# EAGLE design 362MiniProj (EAGLE 7.5.0)
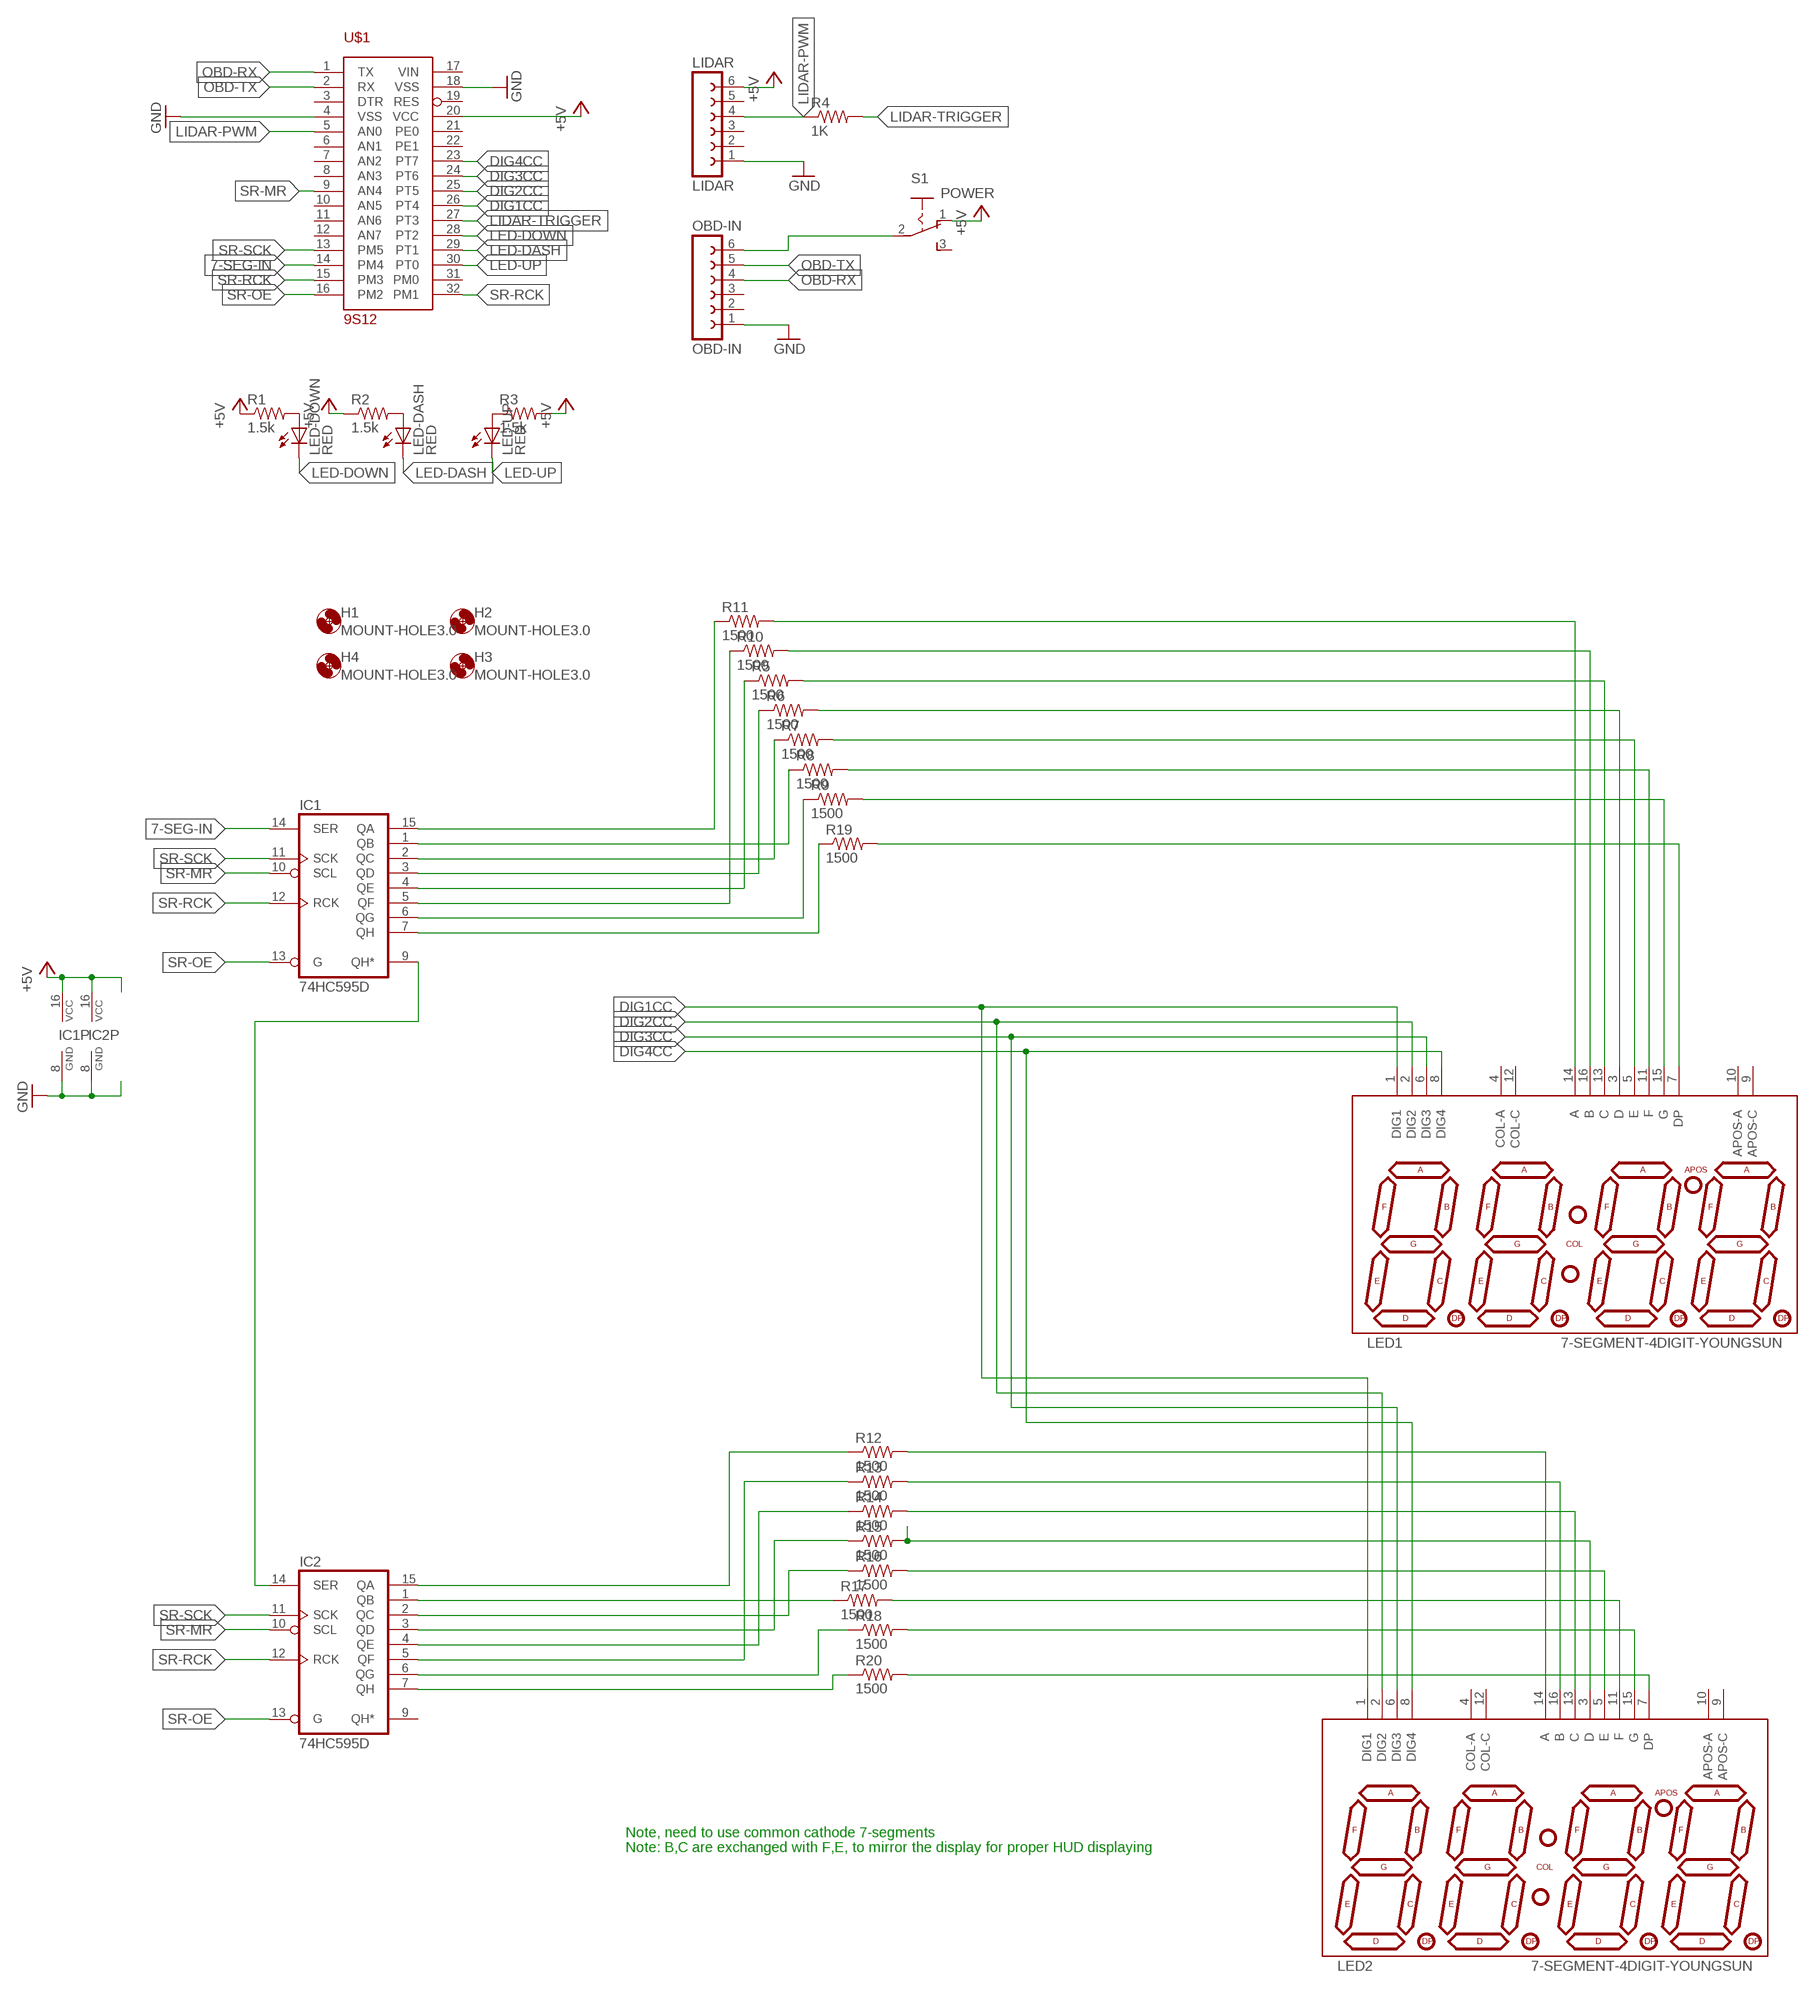
[diagram p0: schematic, sheet 1]

## Parts
H1  MOUNT-HOLE3.0  [3,0]
H2  MOUNT-HOLE3.0  [3,0]
H3  MOUNT-HOLE3.0  [3,0]
H4  MOUNT-HOLE3.0  [3,0]
IC1  74HC595D  [SO16]
IC2  74HC595D  [SO16]
LED1  7-SEGMENT-4DIGIT-YOUNGSUN  [7-SEGMENT-4DIGIT-YOUNGSUN]
LED2  7-SEGMENT-4DIGIT-YOUNGSUN  [7-SEGMENT-4DIGIT-YOUNGSUN]
LED-DASH  RED  LED_E  [LED_1206]
LED-DOWN  RED  LED_E  [LED_1206]
LED-UP  RED  LED_E  [LED_1206]
LIDAR  LIDAR  FE06-1  [FE06]
OBD-IN  OBD-IN  FE06-1  [FE06]
R1  1.5k  R-US_M1206  [M1206]
R2  1.5k  R-US_M1206  [M1206]
R3  1.5k  R-US_M1206  [M1206]
R4  1K  R-US_M1206  [M1206]
R5  1500  R-US_M1206  [M1206]
R6  1500  R-US_M1206  [M1206]
R7  1500  R-US_M1206  [M1206]
R8  1500  R-US_M1206  [M1206]
R9  1500  R-US_M1206  [M1206]
R10  1500  R-US_M1206  [M1206]
R11  1500  R-US_M1206  [M1206]
R12  1500  R-US_M1206  [M1206]
R13  1500  R-US_M1206  [M1206]
R14  1500  R-US_M1206  [M1206]
R15  1500  R-US_M1206  [M1206]
R16  1500  R-US_M1206  [M1206]
R17  1500  R-US_M1206  [M1206]
R18  1500  R-US_M1206  [M1206]
R19  1500  R-US_M1206  [M1206]
R20  1500  R-US_M1206  [M1206]
S1  POWER  M251  [M251]
U$1  9S12  [DIP-32]

## Nets
7-SEG-IN: IC1.14(SER) U$1.14(PM4)
+5V: IC1.16(VCC) IC2.16(VCC) LIDAR.6 R1.1 R2.1 R3.2 S1.1(O) U$1.20(VCC)
DIG1CC: LED1.1(DIG1) LED2.1(DIG1) U$1.26(PT4)
DIG2CC: LED1.2(DIG2) LED2.2(DIG2) U$1.25(PT5)
DIG3CC: LED1.6(DIG3) LED2.6(DIG3) U$1.24(PT6)
DIG4CC: LED1.8(DIG4) LED2.8(DIG4) U$1.23(PT7)
GND: IC1.8(GND) IC2.8(GND) LIDAR.1 OBD-IN.1 U$1.4(VSS) U$1.18(VSS)
LED-DASH: LED-DASH.C U$1.29(PT1)
LED-DOWN: LED-DOWN.C U$1.28(PT2)
LED-UP: LED-UP.C U$1.30(PT0)
LIDAR-PWM: LIDAR.4 R4.1 U$1.5(AN0)
LIDAR-TRIGGER: R4.2 U$1.27(PT3)
N$1: IC1.9(QH*) IC2.14(SER)
N$2: LED-DOWN.A R1.2
N$3: LED-DASH.A R2.2
N$4: LED-UP.A R3.1
N$5: IC1.15(QA) R11.1
N$6: IC1.1(QB) R8.1
N$7: IC1.2(QC) R7.1
N$8: IC1.4(QE) R5.1
N$9: IC1.3(QD) R6.1
N$10: IC1.5(QF) R10.1
N$11: IC1.6(QG) R9.1
N$12: IC1.7(QH) R19.1
N$13: IC2.7(QH) R20.1
N$16: LED1.14(A) R11.2
N$17: OBD-IN.6 S1.2(P)
N$18: LED2.3(D) R15.2
N$19: LED1.16(B) R10.2
N$20: LED1.13(C) R5.2
N$21: LED1.3(D) R6.2
N$22: LED1.5(E) R7.2
N$23: LED1.11(F) R8.2
N$24: LED1.15(G) R9.2
N$26: IC2.15(QA) R12.1
N$27: IC2.5(QF) R13.1
N$28: IC2.4(QE) R14.1
N$29: IC2.3(QD) R15.1
N$30: IC2.2(QC) R16.1
N$31: IC2.1(QB) R17.1
N$32: IC2.6(QG) R18.1
N$33: LED1.7(DP) R19.2
N$34: LED2.14(A) R12.2
N$35: LED2.16(B) R13.2
N$36: LED2.13(C) R14.2
N$37: LED2.5(E) R16.2
N$38: LED2.11(F) R17.2
N$39: LED2.15(G) R18.2
N$41: LED2.7(DP) R20.2
OBD-RX: OBD-IN.4 U$1.1(TX)
OBD-TX: OBD-IN.5 U$1.2(RX)
SR-MR: IC1.10(SCL) IC2.10(SCL) U$1.9(AN4)
SR-OE: IC1.13(G) IC2.13(G) U$1.16(PM2)
SR-RCK: IC1.12(RCK) IC2.12(RCK) U$1.15(PM3) U$1.32(PM1)
SR-SCK: IC1.11(SCK) IC2.11(SCK) U$1.13(PM5)
Unconnected: IC2.9(QH*) LED1.4(COL-A) LED1.9(APOS-C) LED1.10(APOS-A) LED1.12(COL-C) LED2.4(COL-A) LED2.9(APOS-C) LED2.10(APOS-A) LED2.12(COL-C) LIDAR.2 LIDAR.3 LIDAR.5 OBD-IN.2 OBD-IN.3 S1.3(S) U$1.3(DTR) U$1.6(AN1) U$1.7(AN2) U$1.8(AN3) U$1.10(AN5) U$1.11(AN6) U$1.12(AN7) U$1.17(VIN) U$1.19(RES) U$1.21(PE0) U$1.22(PE1) U$1.31(PM0)

## Notes on the sheet
- Note, need to use common cathode 7-segments
- Note: B,C are exchanged with F,E, to mirror the display for proper HUD displaying

## Library data of the parts
H1-H4 = holes:MOUNT-HOLE: MOUNTING HOLE with drill center marker
IC1 IC2 = 74xx-eu:74*595: 8-bit SHIFT REGISTER, output latch
LED1 LED2 = SparkFun-Displays:7-SEGMENT-4DIGIT-YOUNGSUN: This is a part for the 4-Digit 7-segment LEDs from Young Sun. Different from the Digikey LEDs, all 16 pins are used. The LONGPADS Variant is used for a test jig, but you may like it because there is more pad to solder to. If you are concerned about routing space, the standard works just fine though.
LED-DASH LED-DOWN LED-UP = eagle-ltspice:LED_E: LED Source: http://www.osram.convergy.de Source: www.luxeon.com Source: www.kingbright.com; SPICEMODEL: NONE; SPICEPREFIX: D; SPICETYPE: diode
LIDAR OBD-IN = con-lsta:FE06-1: FEMALE HEADER; OC_FARNELL: unknown; OC_NEWARK: unknown
R1-R20 = resistor:R-US_: RESISTOR, American symbol
S1 = switch:M251: SLIDING SWITCH Mors, distributor Buerklin, 11G702
U$1 = 9S12:9S12: 9S12 Breakout 32-pin DIP

## Board
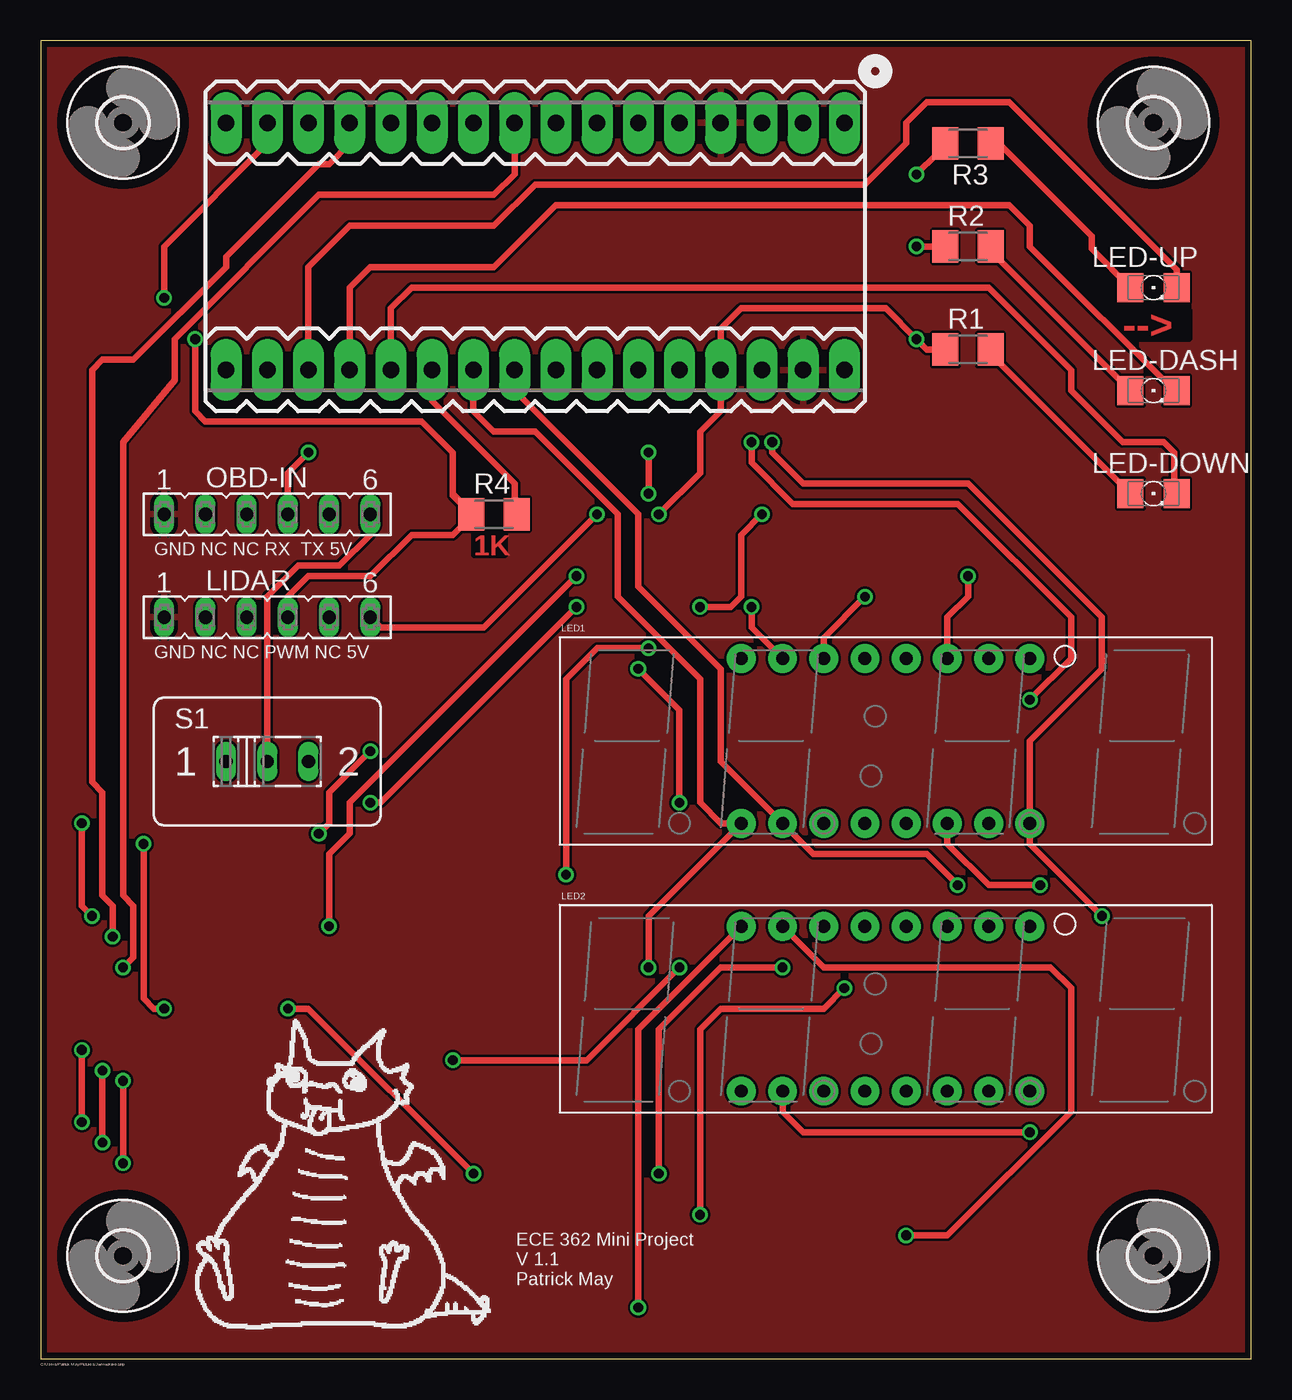
[diagram p1: board, top side]
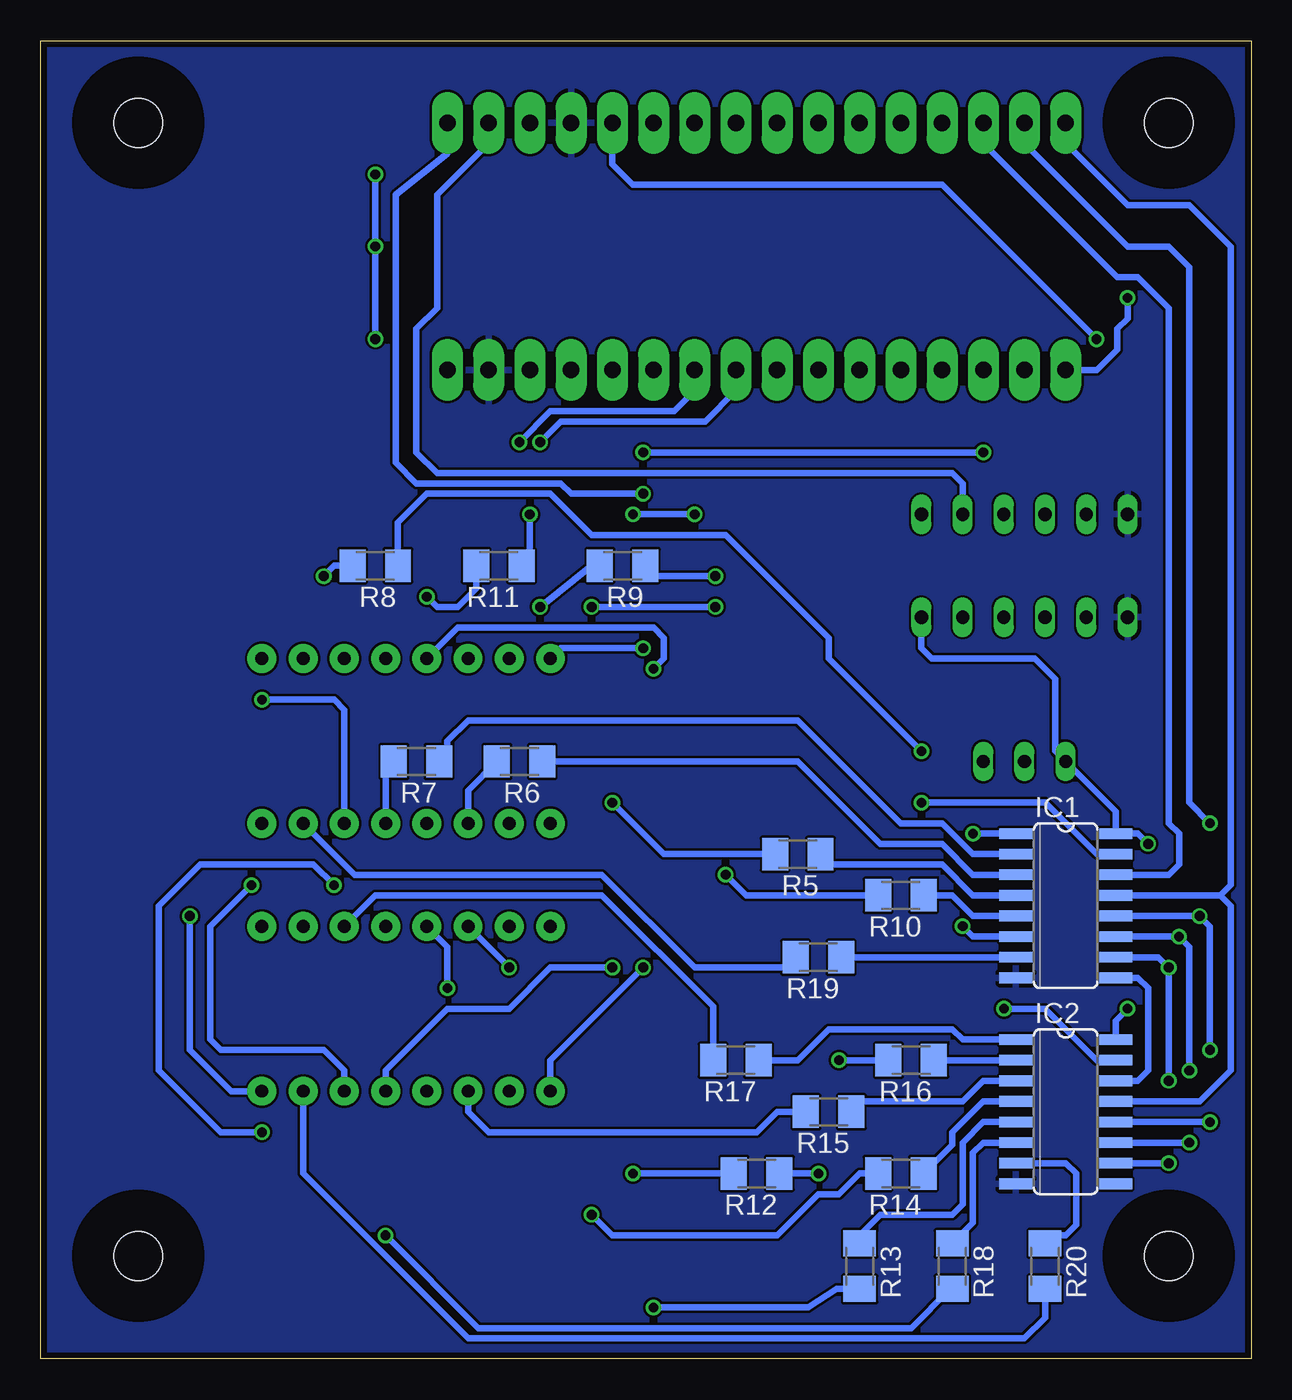
[diagram p2: board, bottom side, seen from below]

Size 74.6 x 81.27 mm. Coordinates in mm from the lower left corner, seen from the top.
Outline: 0,0 74.6,0 74.6,81.27 0,81.27 0,0
Copper layers (1*16): Top 0.0356mm / dielectric 1.5011mm / Bottom 0.0356mm
Design rules "oshpark-2layer": minimum track width 6mil, minimum drill 13mil, track to track 6mil, track to pad 6mil, pad to pad 6mil, via to via 6mil, smd to smd 6mil, copper to edge 15mil, drill to drill 6mil, minimum pad ring 7mil, minimum via ring 7mil, stop-mask expansion 2.5mil, vias tented up to drill 0mil, thermal gap 10mil

### Footprints (pad centres in the part's own frame; a part is rotated, then mirrored left to right if it is on the bottom)
3,0 = hole 3: 0,0
SO16 = smd 0.66 x 2.032: 1 -4.445,-3.073; 2 -3.175,-3.073; 3 -1.905,-3.073; 4 -0.635,-3.073; 5 0.635,-3.073; 6 1.905,-3.073; 7 3.175,-3.073; 8 4.445,-3.073; 9 4.445,3.073; 10 3.175,3.073; 11 1.905,3.073; 12 0.635,3.073; 13 -0.635,3.073; 14 -1.905,3.073; 15 -3.175,3.073; 16 -4.445,3.073
7-SEGMENT-4DIGIT-YOUNGSUN = drill 0.8 pad 1.778: 1 -8.89,-5.08; 2 -6.35,-5.08; 3 -3.81,-5.08; 4 -1.27,-5.08; 5 1.27,-5.08; 6 3.81,-5.08; 7 6.35,-5.08; 8 8.89,-5.08; 9 8.89,5.08; 10 6.35,5.08; 11 3.81,5.08; 12 1.27,5.08; 13 -1.27,5.08; 14 -3.81,5.08; 15 -6.35,5.08; 16 -8.89,5.08
LED_1206 = smd 1.6 x 1.803: A -1.422,0; C 1.422,0
FE06 = drill 0.813 long: 1 -6.35,0; 2 -3.81,0; 3 -1.27,0; 4 1.27,0; 5 3.81,0; 6 6.35,0
M1206 = smd 1.6 x 2: 1 -1.4,0; 2 1.4,0
M251 = drill 0.813 long: 1 -2.54,0; 2 0,0; 3 2.54,0
DIP-32 = drill 1.016 pad 1.905 long: 1 -7.62,20.32; 2 -7.62,17.78; 3 -7.62,15.24; 4 -7.62,12.7; 5 -7.62,10.16; 6 -7.62,7.62; 7 -7.62,5.08; 8 -7.62,2.54; 9 -7.62,0; 10 -7.62,-2.54; 11 -7.62,-5.08; 12 -7.62,-7.62; 13 -7.62,-10.16; 14 -7.62,-12.7; 15 -7.62,-15.24; 16 -7.62,-17.78; 17 7.62,20.32; 18 7.62,17.78; 19 7.62,15.24; 20 7.62,12.7; 21 7.62,10.16; 22 7.62,7.62; 23 7.62,5.08; 24 7.62,2.54; 25 7.62,0; 26 7.62,-2.54; 27 7.62,-5.08; 28 7.62,-7.62; 29 7.62,-10.16; 30 7.62,-12.7; 31 7.62,-15.24; 32 7.62,-17.78

### Placement (x,y rotation side)
H1  5.08,6.35 0 top
H2  68.58,6.35 0 top
H3  68.58,76.2 0 top
H4  5.08,76.2 0 top
IC1  11.43,27.94 270 bottom
IC2  11.43,15.24 270 bottom
LED1  52.07,38.1 0 top
LED2  52.07,21.59 0 top
LED-DASH  68.58,59.69 0 top
LED-DOWN  68.58,53.34 0 top
LED-UP  68.58,66.04 0 top
LIDAR  13.97,45.72 0 top
OBD-IN  13.97,52.07 0 top
R1  57.15,62.23 0 top
R2  57.15,68.58 0 top
R3  57.15,74.93 180 top
R4  27.94,52.07 0 top
R5  27.94,31.11 180 bottom
R6  45.09,36.83 180 bottom
R7  51.44,36.83 180 bottom
R8  53.98,48.9 180 bottom
R9  38.73,48.9 180 bottom
R10  21.59,28.57 180 bottom
R11  46.35,48.9 180 bottom
R12  30.48,11.43 180 bottom
R13  24.13,5.71 270 bottom
R14  21.59,11.43 180 bottom
R15  26.04,15.24 180 bottom
R16  20.95,18.41 180 bottom
R17  31.75,18.41 180 bottom
R18  18.41,5.71 270 bottom
R19  26.67,24.77 180 bottom
R20  12.7,5.71 270 bottom
S1  13.97,36.83 0 top
U$1  29.21,68.58 270 top

### Tracks (layer width: path | path; a pad name or v marks a point on that pad's centre or on a via)
7-SEG-IN
  Bottom 0.406: U$1.14 16.51,74.93 8.26,66.67 6.99,66.67 5.08,64.77 5.08,33.02 4.45,32.38 4.45,30.48 5.08,29.84 IC1.14
+5V  (via drill 0.6)
  Top 0.406: v7.62,21.59 6.99,21.59 6.35,22.23 v6.35,31.75 | R1.1 54.61,62.23 v53.98,62.87 52.07,64.77 43.18,64.77 41.91,63.5 U$1.20 41.91,58.42 40.64,57.15 40.64,54.61 v38.1,52.07 | v53.98,73.03 55.24,74.3 55.24,74.42 R3.2 | R2.1 v53.98,68.58 | v34.29,52.07 27.3,45.09 20.95,45.09 LIDAR.6
  Bottom 0.406: IC2.16 8.36,20.85 v7.62,21.59 | v6.35,31.75 6.99,32.38 IC1.16 8.36,33.76 S1.1 12.06,37.47 12.06,41.91 13.34,43.18 19.68,43.18 20.32,43.81 LIDAR.6 | v53.98,62.87 v53.98,68.58 v53.98,73.03 | v38.1,52.07 v34.29,52.07
DIG1CC  (via drill 0.6)
  Top 0.406: v37.47,24.13 37.47,27.3 LED1.1 41.91,33.02 40.64,34.29 40.64,41.91 35.56,46.99 35.56,52.07 30.48,57.15 27.94,57.15 26.67,58.42 U$1.26
  Bottom 0.406: LED2.1 43.18,18.41 v37.47,24.13
DIG2CC  (via drill 0.6)
  Top 0.406: LED2.2 45.72,15.24 46.99,13.97 v60.96,13.97 | v56.52,29.21 54.61,31.11 47.62,31.11 LED1.2 41.91,36.83 41.91,42.55 36.83,47.62 36.83,52.07 29.21,59.69 U$1.25
  Bottom 0.406: v60.96,13.97 63.5,13.97 67.31,17.78 67.31,27.94 64.77,30.48 57.78,30.48 v56.52,29.21
DIG3CC  (via drill 0.6)
  Top 0.406: v61.59,29.21 58.42,29.21 55.88,31.75 LED1.6 | v43.81,56.52 43.81,55.24 46.35,52.7 56.52,52.7 63.5,45.72 63.5,43.18 v60.96,40.64
  Bottom 0.406: LED2.6 55.88,17.78 57.15,19.05 63.5,19.05 64.14,19.68 64.14,26.67 v61.59,29.21 | U$1.24 31.75,59.69 33.66,57.78 42.55,57.78 v43.81,56.52 | v60.96,40.64 56.52,40.64 55.88,40.01 LED1.6
DIG4CC  (via drill 0.6)
  Top 0.406: v65.41,27.3 60.96,31.75 LED1.8 60.96,38.1 65.41,42.55 65.41,45.72 57.15,53.98 46.99,53.98 45.09,55.88 v45.09,56.52
  Bottom 0.406: LED2.8 62.87,16.51 65.41,19.05 v65.41,27.3 | U$1.23 34.29,59.69 35.56,58.42 43.18,58.42 v45.09,56.52
GND
  pour Bottom: 0,81.28 74.93,81.28 74.93,0 0,0
  pour Top: 0,81.28 74.93,81.28 74.93,0 0,0
LED-DASH
  Top 0.406: LED-DASH.C 69.85,59.69 60.96,68.58 60.96,69.85 59.69,71.12 31.75,71.12 27.94,67.31 20.32,67.31 19.05,66.04 U$1.29
LED-DOWN
  Top 0.406: U$1.28 21.59,64.77 22.86,66.04 58.42,66.04 63.5,60.96 63.5,59.69 66.67,56.52 69.22,56.52 69.85,55.88 69.85,53.49 LED-DOWN.C
LED-UP
  Top 0.406: LED-UP.C 70,67.16 59.69,77.47 54.61,77.47 53.34,76.2 53.34,74.93 50.8,72.39 30.48,72.39 27.94,69.85 19.05,69.85 16.51,67.31 U$1.30
LIDAR-PWM  (via drill 0.6)
  Top 0.406: v9.53,62.87 9.53,58.42 10.16,57.78 23.5,57.78 25.4,55.88 25.4,53.21 | 25.4,53.21 R4.1 | 25.4,53.21 25.53,53.21 26.04,52.7 26.04,51.44 25.4,50.8 22.86,50.8 20.32,48.26 16.51,48.26 15.24,46.99 LIDAR.4
  Bottom 0.406: U$1.5 39.37,73.66 38.1,72.39 19.05,72.39 v9.53,62.87
LIDAR-TRIGGER
  Top 0.406: U$1.27 24.13,59.05 29.21,53.98 29.21,52.2 R4.2
N$1
  Bottom 0.406: IC1.9 6.99,23.5 6.35,22.86 6.35,17.78 6.99,17.14 IC2.14
N$2
  Top 0.406: R1.2 58.55,61.95 LED-DOWN.A
N$3
  Top 0.406: R2.2 58.55,68.3 LED-DASH.A
N$4
  Top 0.406: R3.1 59.05,74.93 64.77,69.22 64.77,68.43 LED-UP.A
N$5  (via drill 0.6)
  Top 0.406: v20.32,34.29 20.95,34.29 v33.02,46.35 | v40.64,46.35 42.55,46.35 43.18,46.99 43.18,50.8 v44.45,52.07
  Bottom 0.406: IC1.15 9.53,31.11 12.7,34.29 v20.32,34.29 | v33.02,46.35 v40.64,46.35 | v44.45,52.07 44.45,49.4 R11.1
N$6  (via drill 0.6)
  Top 0.406: v20.32,37.47 17.78,34.92 17.78,33.02 v17.14,32.38
  Bottom 0.406: R8.1 52.58,51.56 50.8,53.34 43.18,53.34 40.64,50.8 32.38,50.8 26.04,44.45 26.04,43.18 v20.32,37.47 | v17.14,32.38 IC1.1
N$7
  Bottom 0.406: IC1.2 17.14,31.11 19.05,33.02 21.59,33.02 27.94,39.37 48.26,39.37 49.53,38.1 49.53,37.34 R7.1
N$8
  Bottom 0.406: IC1.4 17.14,28.57 19.05,30.48 25.91,30.48 R5.1
N$9
  Bottom 0.406: IC1.3 17.14,29.84 19.05,31.75 22.86,31.75 27.94,36.83 R6.1
N$10
  Bottom 0.406: IC1.5 17.14,27.3 18.41,28.57 R10.1
N$11  (via drill 0.6)
  Top 0.406: v17.78,26.67 17.78,31.11 19.05,32.38 19.05,34.29 v33.02,48.26
  Bottom 0.406: IC1.6 17.14,26.04 v17.78,26.67 | v33.02,48.26 36.7,48.26 R9.1
N$12
  Bottom 0.406: IC1.7 R19.1
N$13
  Bottom 0.406: IC2.7 11.43,12.06 10.79,11.43 10.79,8.26 11.43,7.62 12.2,7.62 R20.1
N$16  (via drill 0.6)
  Top 0.406: v50.8,46.99 48.26,44.45 LED1.14
  Bottom 0.406: R11.2 47.76,47.49 48.9,46.35 50.16,46.35 v50.8,46.99
N$17
  Top 0.406: S1.2 13.97,46.99 15.88,48.9 18.41,48.9 20.32,50.8 OBD-IN.6
N$18
  Bottom 0.406: R15.2 29.21,15.24 30.48,13.97 46.99,13.97 48.26,15.24 LED2.3
N$19  (via drill 0.6)
  Top 0.406: v32.38,29.84 32.38,41.91 34.29,43.81 v37.47,43.81
  Bottom 0.406: R10.2 31.11,28.57 v32.38,29.84 | v37.47,43.81 42.55,43.81 LED1.16
N$20  (via drill 0.6)
  Top 0.406: v39.37,34.29 39.37,40.01 v36.83,42.55
  Bottom 0.406: R5.2 36.2,31.11 v39.37,34.29 | v36.83,42.55 36.2,43.18 36.2,44.45 36.83,45.09 48.9,45.09 LED1.13
N$21
  Bottom 0.406: LED1.3 48.26,35.05 R6.2
N$22
  Bottom 0.406: LED1.5 53.34,36.33 R7.2
N$23  (via drill 0.6)
  Top 0.406: v57.15,48.26 57.15,46.99 55.88,45.72 LED1.11
  Bottom 0.406: R8.2 56.52,48.9 v57.15,48.26
N$24  (via drill 0.6)
  Top 0.406: v43.81,46.35 43.81,45.09 LED1.15
  Bottom 0.406: R9.2 40.64,48.9 v43.81,46.35
N$26  (via drill 0.6)
  Top 0.406: v15.24,21.59 16.51,21.59 v26.67,11.43
  Bottom 0.406: IC2.15 9.53,18.41 12.7,21.59 v15.24,21.59 | v26.67,11.43 R12.1
N$27
  Bottom 0.406: R13.1 24.13,7.62 22.86,8.89 18.41,8.89 17.78,9.53 17.78,13.34 16.51,14.61 IC2.5
N$28
  Bottom 0.406: IC2.4 16.51,15.88 18.41,13.97 18.41,13.21 R14.1
N$29
  Bottom 0.406: IC2.3 16.51,17.14 17.78,15.88 24.13,15.88 24.13,15.74 R15.1
N$30
  Bottom 0.406: R16.1 IC2.2
N$31
  Bottom 0.406: IC2.1 17.78,19.68 18.41,20.32 26.04,20.32 27.94,18.41 R17.1
N$32
  Bottom 0.406: IC2.6 16.51,13.34 17.14,12.7 17.14,8.38 R18.1
N$33
  Bottom 0.406: LED1.7 55.24,29.84 40.01,29.84 34.29,24.13 28.7,24.13 R19.2
N$34  (via drill 0.6)
  Top 0.406: v38.1,11.43 38.1,20.32 41.91,24.13 v45.72,24.13
  Bottom 0.406: R12.2 v38.1,11.43 | v45.72,24.13 LED2.14
N$35  (via drill 0.6)
  Top 0.406: v36.83,3.17 36.83,20.32 LED2.16
  Bottom 0.406: R13.2 25.53,4.32 27.3,3.17 v36.83,3.17
N$36  (via drill 0.6)
  Top 0.406: v40.64,8.89 40.64,20.32 41.91,21.59 48.26,21.59 v49.53,22.86
  Bottom 0.406: R14.2 24.13,11.43 25.4,10.16 26.67,10.16 29.21,7.62 39.37,7.62 v40.64,8.89 | v49.53,22.86 49.53,25.4 LED2.13
N$37  (via drill 0.6)
  Top 0.406: v25.4,18.41 33.66,18.41 v39.37,24.13
  Bottom 0.406: R16.2 v25.4,18.41 | v39.37,24.13 43.18,24.13 45.72,21.59 49.53,21.59 53.34,17.78 LED2.5
N$38
  Bottom 0.406: R17.2 33.15,21.72 40.01,28.57 53.98,28.57 LED2.11
N$39  (via drill 0.6)
  Top 0.406: v53.34,7.62 55.88,7.62 63.5,15.24 63.5,22.86 62.23,24.13 48.26,24.13 LED2.15
  Bottom 0.406: R18.2 18.55,4.32 20.95,1.91 47.62,1.91 v53.34,7.62
N$41
  Bottom 0.406: R20.2 12.7,2.54 13.97,1.27 48.26,1.27 58.42,11.43 LED2.7
OBD-RX  (via drill 0.6)
  Top 0.406: OBD-IN.4 15.24,54.61 v16.51,55.88 | v37.47,55.88 v37.47,53.34
  Bottom 0.406: U$1.1 49.53,74.3 52.7,71.75 52.7,55.24 51.44,53.98 42.55,53.98 41.91,53.34 v37.47,53.34 | v16.51,55.88 v37.47,55.88
OBD-TX
  Bottom 0.406: U$1.2 46.99,74.93 50.16,71.75 50.16,64.77 51.44,63.5 51.44,55.88 50.16,54.61 18.41,54.61 17.78,53.98 OBD-IN.5
SR-MR  (via drill 0.6)
  Top 0.406: v5.08,17.14 v5.08,12.06 | U$1.9 29.21,73.03 27.94,71.75 17.14,71.75 8.26,62.87 8.26,60.33 5.08,56.52 5.08,28.57 5.71,27.94 5.71,24.77 v5.08,24.13
  Bottom 0.406: IC1.10 5.71,24.77 v5.08,24.13 v5.08,17.14 | v5.08,12.06 IC2.10
SR-OE
  Bottom 0.406: IC1.13 1.91,28.57 | 1.91,28.57 1.27,27.94 1.27,17.78 3.17,15.88 IC2.13 | U$1.16 11.43,74.93 7.62,71.12 3.81,71.12 1.27,68.58 1.27,29.21 1.91,28.57
SR-RCK  (via drill 0.6)
  Top 0.406: v2.54,19.05 v2.54,14.61 | v2.54,33.02 2.54,27.94 v3.17,27.3 | v7.62,65.41 7.62,68.58 13.97,74.93 U$1.15
  Bottom 0.406: IC1.12 v3.17,27.3 2.54,26.67 v2.54,19.05 | v2.54,14.61 IC2.12 | U$1.15 13.97,74.93 7.62,68.58 5.08,68.58 3.81,67.31 3.81,34.29 v2.54,33.02 | U$1.32 9.53,60.96 8.26,62.23 8.26,63.5 7.62,64.14 v7.62,65.41
SR-SCK  (via drill 0.6)
  Top 0.406: v3.81,17.78 v3.81,13.34 | v4.45,26.04 4.45,27.94 3.81,28.57 3.81,34.92 3.17,35.56 3.17,60.96 3.81,61.59 5.71,61.59 11.43,67.31 11.43,67.94 17.14,73.66 17.78,73.66 19.05,74.93 U$1.13
  Bottom 0.406: IC1.11 v4.45,26.04 3.81,25.4 v3.81,17.78 | v3.81,13.34 IC2.11

### Text on the board
Top: -->
tPlace: GND NC NC RX TX 5V | GND NC NC PWM NC 5V | ECE 362 Mini Project / V 1.1 / Patrick May | C:/Users/Patrick May/Pictures/Jaenadrake.bmp
tStop: --> | 1K